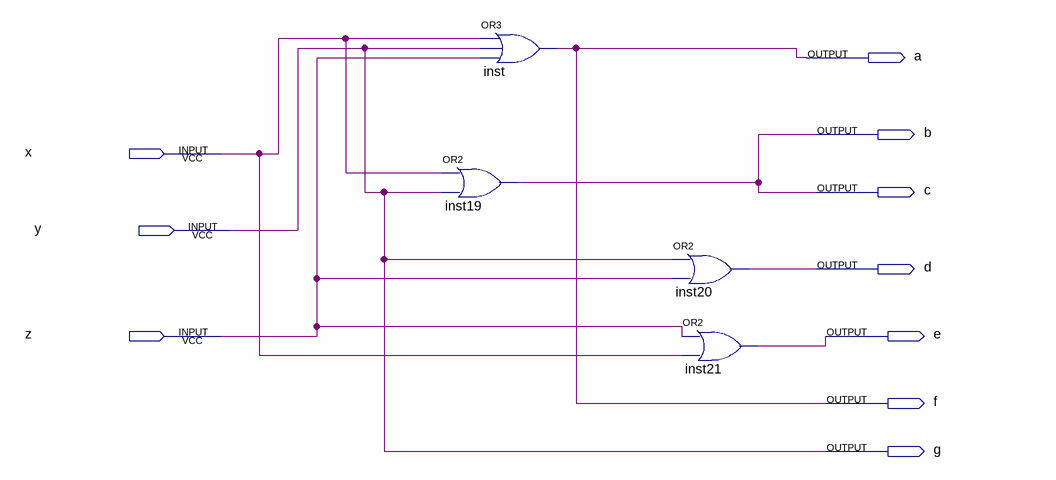
[diagram p0: schematic sheet]
// Quartus schematic fndarray0.bdf as structural Verilog: 4 symbols, 10 pins
module fndarray0 (
  input  x,
  input  y,
  input  z,
  output a,
  output b,
  output c,
  output d,
  output e,
  output f,
  output g
);

  or inst19 (b, x, y);
  or inst (a, x, y, z);
  or inst20 (d, y, z);
  or inst21 (e, z, x);

  assign c = b;
  assign f = a;
  assign g = y;
endmodule
